# Altium schematic sheet Top.SchDoc
size A
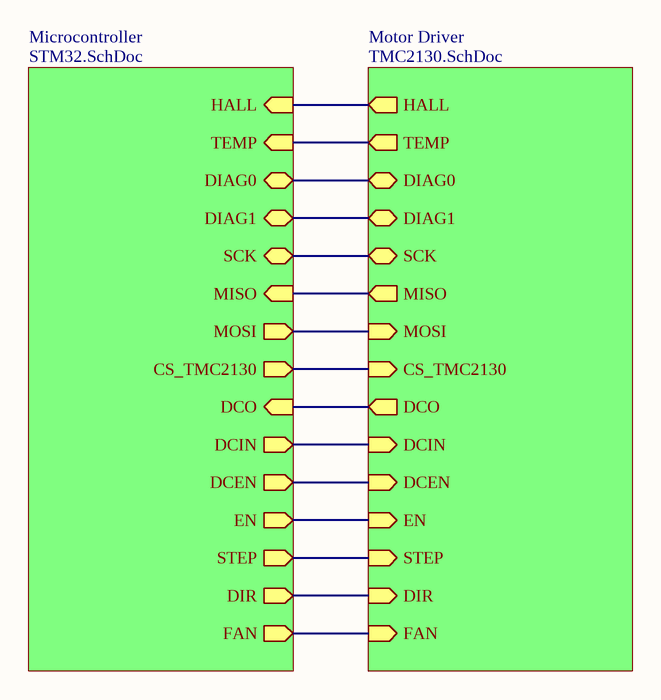
[diagram p0: Top.SchDoc]

## Sub-sheets
Microcontroller = STM32.SchDoc: CS_TMC2130 (out), DIR (out), MISO (in), MOSI (out), SCK (bidir), EN (out), DIAG0 (bidir), HALL (in), DCO (in), DCEN (out), TEMP (in), DIAG1 (bidir), DCIN (out), STEP (out), FAN (out)
Motor Driver = TMC2130.SchDoc: DIAG1 (bidir), DIAG0 (bidir), DCO (out), DCIN (in), TEMP (out), HALL (out), DCEN (in), MOSI (in), SCK (bidir), MISO (out), STEP (in), DIR (in), EN (in), CS_TMC2130 (in), FAN (in)

## Nets
(unnamed): sheet Microcontroller/CS_TMC2130, sheet Motor Driver/CS_TMC2130
(unnamed): sheet Microcontroller/DIR, sheet Motor Driver/DIR
(unnamed): sheet Microcontroller/MISO, sheet Motor Driver/MISO
(unnamed): sheet Microcontroller/MOSI, sheet Motor Driver/MOSI
(unnamed): sheet Microcontroller/SCK, sheet Motor Driver/SCK
(unnamed): sheet Microcontroller/EN, sheet Motor Driver/EN
(unnamed): sheet Microcontroller/DIAG0, sheet Motor Driver/DIAG0
(unnamed): sheet Microcontroller/HALL, sheet Motor Driver/HALL
(unnamed): sheet Microcontroller/DCO, sheet Motor Driver/DCO
(unnamed): sheet Microcontroller/DCEN, sheet Motor Driver/DCEN
(unnamed): sheet Microcontroller/TEMP, sheet Motor Driver/TEMP
(unnamed): sheet Microcontroller/DIAG1, sheet Motor Driver/DIAG1
(unnamed): sheet Microcontroller/DCIN, sheet Motor Driver/DCIN
(unnamed): sheet Microcontroller/STEP, sheet Motor Driver/STEP
(unnamed): sheet Microcontroller/FAN, sheet Motor Driver/FAN

## Notes on the sheet
- Title
- Size:
- Date:
- A
- Number:
- Time:
- Revision:
- Sheet
- of
- File: